# Altium project PCB_Project.PrjPcb (part 2 of 2)
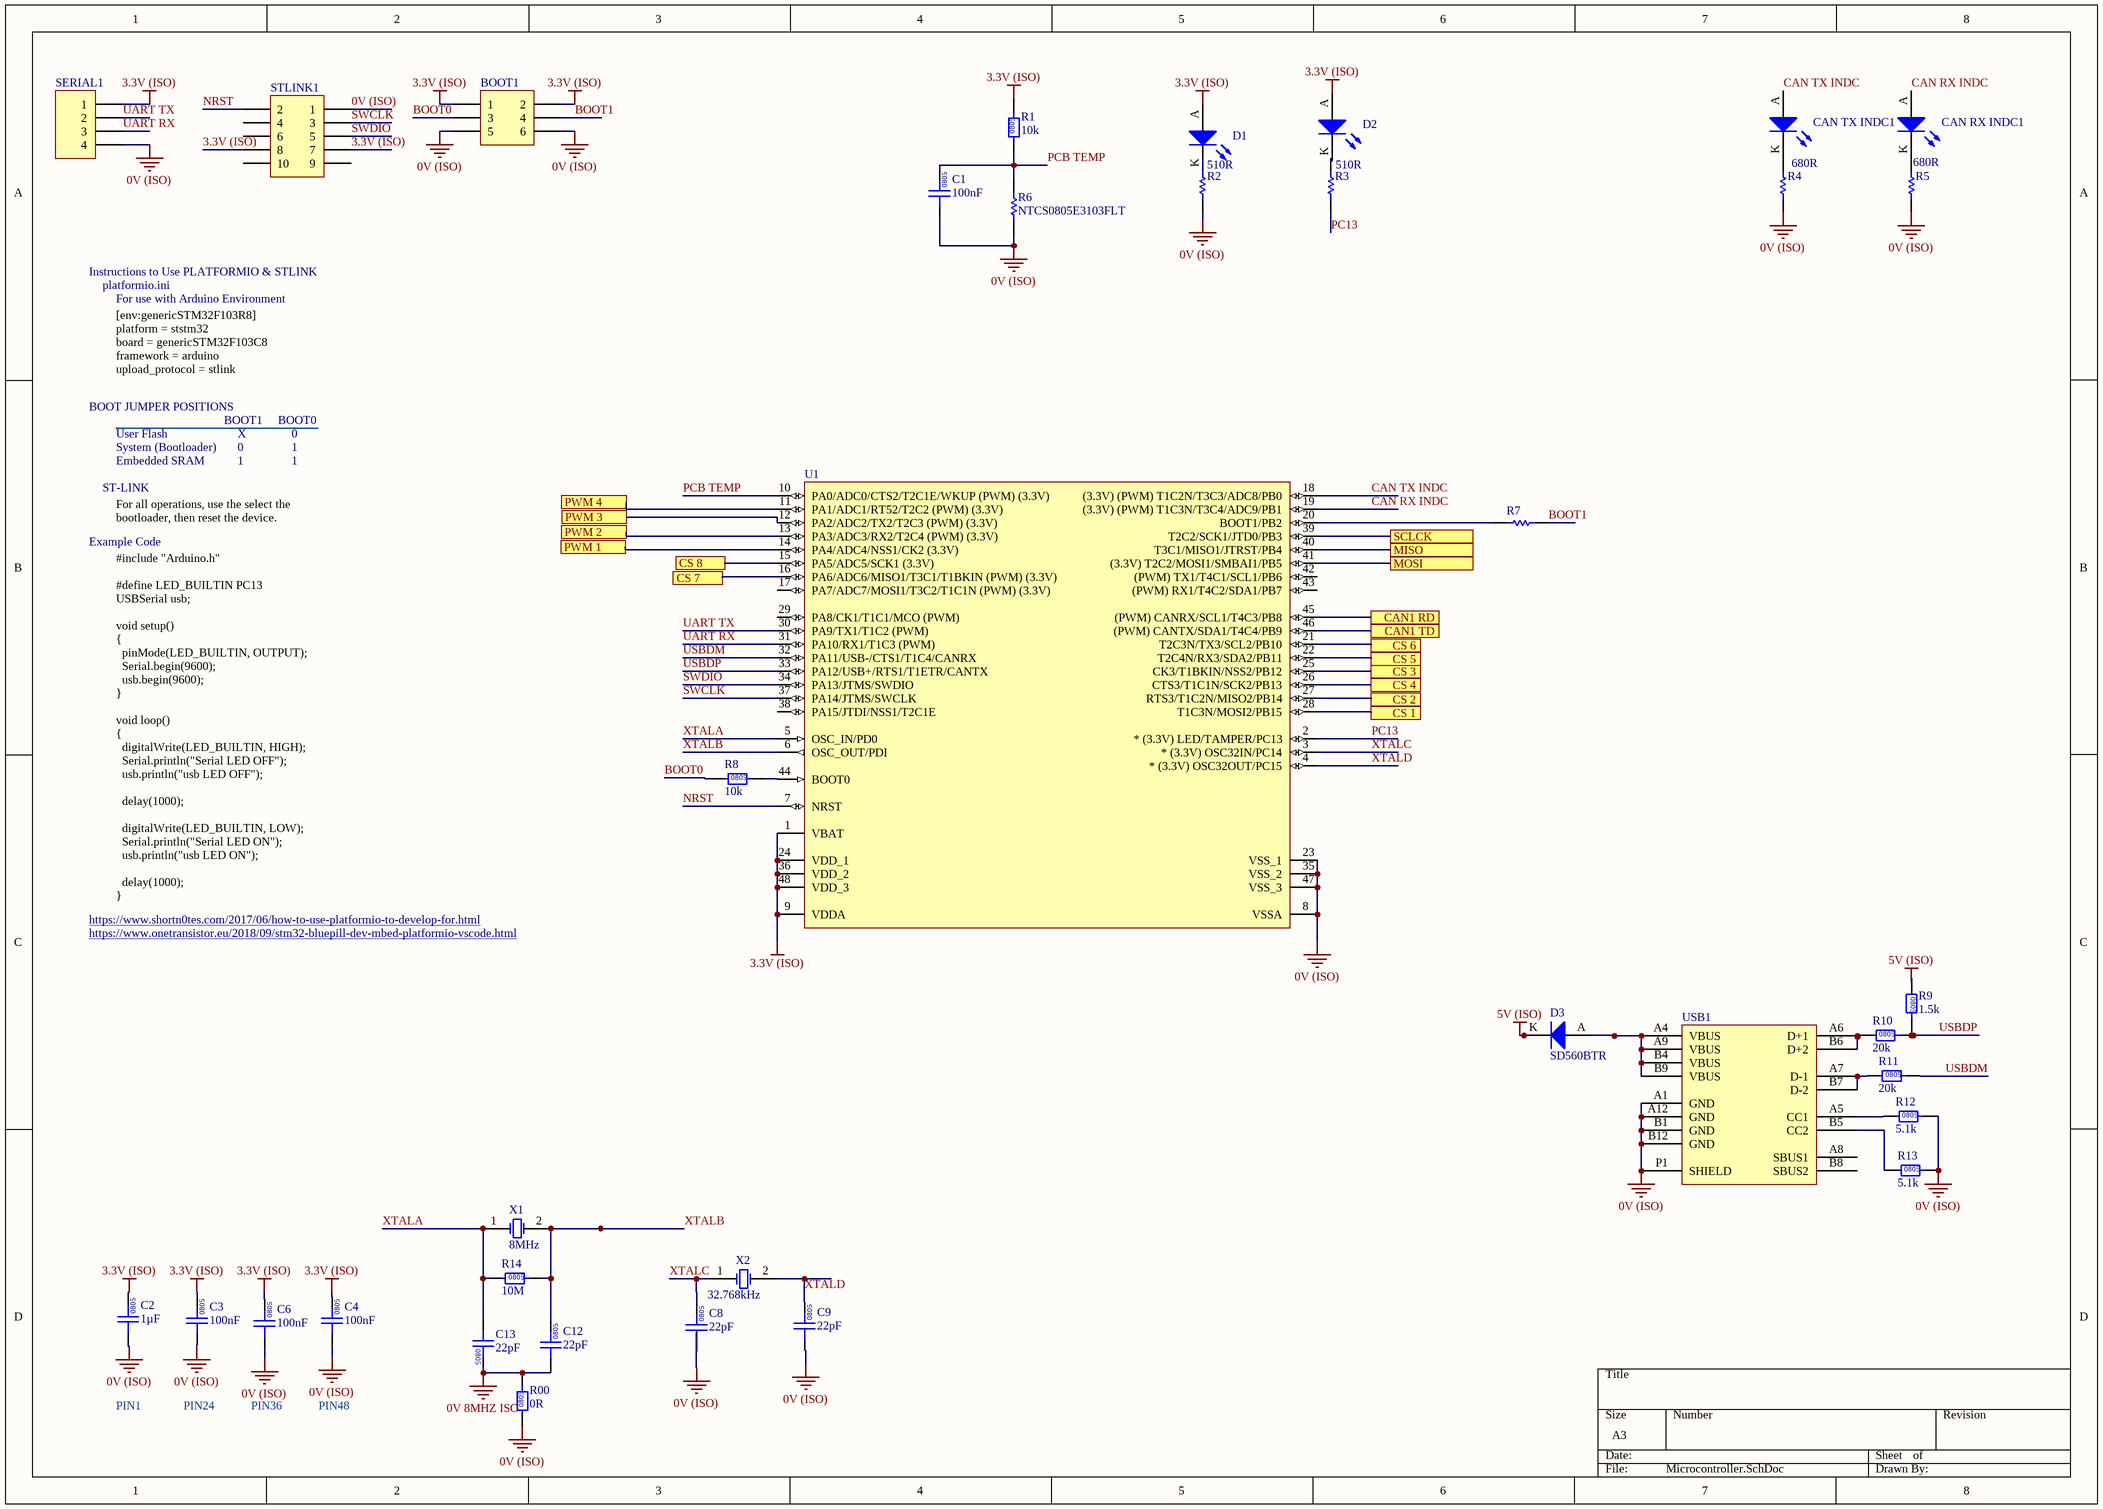
[diagram p9: Microcontroller.SchDoc]

## Nets that join several sheets
0V: Top_Level (6 pins), Power Supply (15 pins), Power Outputs (12 pins), Power Outputs/SD1 (9 pins), Power Outputs/SD2 (9 pins), Power Outputs/SD3 (9 pins), Power Outputs/SD4 (9 pins), PWM Signal Isolation (U14.9 U14.15), Digital Isolation (6 pins), HBA (9 pins), HBB (9 pins), HBC (9 pins), HBD (9 pins)
0V (ISO): Power Supply (8 pins), CAN (9 pins), PWM Signal Isolation (U14.2 U14.8), Digital Isolation (6 pins), Microcontroller (27 pins)
3.3V (ISO): Power Supply (C34.2 C38.2 U6.5), PWM Signal Isolation (U14.1), Digital Isolation (U10.1 U11.1 U12.1 U12.7), Microcontroller (17 pins)
5V: Power Supply (6 pins), Power Outputs (15 pins), PWM Signal Isolation (U14.10 U14.16), Digital Isolation (6 pins), HBA (R39_HBA.2 U13_HBA.2), HBB (R39_HBB.2 U13_HBB.2), HBC (R39_HBC.2 U13_HBC.2), HBD (R39_HBD.2 U13_HBD.2)
5V (ISO): Power Supply (7 pins), CAN (6 pins), Microcontroller (D3.K R9.1)
24V PWR: Power Supply (*1.5 *2.8 C24.2 F1.1), Power Outputs/SD1 (U3_SD1.15), Power Outputs/SD2 (U3_SD2.15), Power Outputs/SD3 (U3_SD3.15), Power Outputs/SD4 (U3_SD4.15)
ADC CS (ISO): Digital Isolation (U10.3), Microcontroller (U1.28)
ADC CS (NON ISO): Power Outputs (*6.11 R32.1), Digital Isolation (U10.14)
CAN_H: Top_Level (J1.6), CAN (C47.2 U8.2)
CAN_L: Top_Level (J1.5), CAN (C48.2 U8.1)
CANS: Top_Level (J1.7), CAN (14 pins)
CURRENT SENSE CH1: Power Outputs (*6.15), Power Outputs/SD1 (C15_SD1.2 R15_SD1.1)
CURRENT SENSE CH2: Power Outputs (*6.16), Power Outputs/SD1 (C14_SD1.2 R16_SD1.2)
CURRENT SENSE CH3: Power Outputs (*6.1), Power Outputs/SD2 (C15_SD2.2 R15_SD2.1)
CURRENT SENSE CH4: Power Outputs (*6.2), Power Outputs/SD2 (C14_SD2.2 R16_SD2.2)
CURRENT SENSE CH5: Power Outputs (*6.3), Power Outputs/SD3 (C15_SD3.2 R15_SD3.1)
CURRENT SENSE CH6: Power Outputs (*6.4), Power Outputs/SD3 (C14_SD3.2 R16_SD3.2)
CURRENT SENSE CH7: Power Outputs (*6.5), Power Outputs/SD4 (C15_SD4.2 R15_SD4.1)
CURRENT SENSE CH8: Power Outputs (*6.6), Power Outputs/SD4 (C14_SD4.2 R16_SD4.2)
DIAGNOSTIC EN A: Power Outputs (*4.15), Power Outputs/SD1 (R19_SD1.1)
DIAGNOSTIC EN B: Power Outputs (*4.16), Power Outputs/SD2 (R19_SD2.1)
DIAGNOSTIC EN C: Power Outputs (*4.1), Power Outputs/SD3 (R19_SD3.1)
DIAGNOSTIC EN D: Power Outputs (*4.2), Power Outputs/SD4 (R19_SD4.1)
GLV+: Top_Level (J1.1 J1.2), Power Supply (J2.1 J2.2)
H Bridge A CS: Digital Isolation (U11.14), HBA (R39_HBA.1 U13_HBA.9)
H Bridge A CS (ISO): Digital Isolation (U11.3), Microcontroller (U1.22)
H Bridge A Direction: Power Outputs (*4.3), HBA (U13_HBA.1)
H Bridge A OUT1: Top_Level (J1.28), HBA (C66_HBA.2 U13_HBA.5)
H Bridge A OUT2: Top_Level (J1.27), HBA (C67_HBA.2 U13_HBA.7)
H Bridge A Power: Power Outputs/SD3 (5 pins), HBA (C60_HBA.2 C65_HBA.2 U13_HBA.4)
H Bridge B CS: Digital Isolation (U11.13), HBB (R39_HBB.1 U13_HBB.9)
H Bridge B CS (ISO): Digital Isolation (U11.4), Microcontroller (U1.21)
H Bridge B Direction: Power Outputs (*4.4), HBB (U13_HBB.1)
H Bridge B OUT1: Top_Level (J1.30), HBB (C66_HBB.2 U13_HBB.5)
H Bridge B OUT2: Top_Level (J1.29), HBB (C67_HBB.2 U13_HBB.7)
H Bridge B Power: Power Outputs/SD3 (5 pins), HBB (C60_HBB.2 C65_HBB.2 U13_HBB.4)
H Bridge C CS: Digital Isolation (U11.12), HBC (R39_HBC.1 U13_HBC.9)
H Bridge C CS (ISO): Digital Isolation (U11.5), Microcontroller (U1.16)
H Bridge C Direction: Power Outputs (*4.5), HBC (U13_HBC.1)
H Bridge C OUT1: Top_Level (J1.25), HBC (C66_HBC.2 U13_HBC.5)
H Bridge C OUT2: Top_Level (J1.34), HBC (C67_HBC.2 U13_HBC.7)
H Bridge C Power: Power Outputs/SD4 (5 pins), HBC (C60_HBC.2 C65_HBC.2 U13_HBC.4)
H Bridge D CS: Digital Isolation (U11.11), HBD (R39_HBD.1 U13_HBD.9)
H Bridge D CS (ISO): Digital Isolation (U11.6), Microcontroller (U1.15)
H Bridge D Direction: Power Outputs (*4.6), HBD (U13_HBD.1)
H Bridge D OUT1: Top_Level (J1.8), HBD (C66_HBD.2 U13_HBD.5)
H Bridge D OUT2: Top_Level (J1.9), HBD (C67_HBD.2 U13_HBD.7)
H Bridge D Power: Power Outputs/SD4 (5 pins), HBD (C60_HBD.2 C65_HBD.2 U13_HBD.4)
MISO: Power Outputs (*4.12 *5.12 *6.12), Digital Isolation (R38.2), HBA (U13_HBA.3), HBB (U13_HBB.3), HBC (U13_HBC.3), HBD (U13_HBD.3)
MISO (ISO): Digital Isolation (R37.1), Microcontroller (U1.40)
MOSI: Power Outputs (*4.14 *5.14 *6.14), Digital Isolation (R33.1), HBA (U13_HBA.8), HBB (U13_HBB.8), HBC (U13_HBC.8), HBD (U13_HBD.8)
MOSI (ISO): Digital Isolation (R34.1), Microcontroller (U1.41)
NetU1_11: PWM Signal Isolation (U14.6), Microcontroller (U1.11)
NetU1_12: PWM Signal Isolation (U14.5), Microcontroller (U1.12)
NetU1_13: PWM Signal Isolation (U14.4), Microcontroller (U1.13)
NetU1_14: PWM Signal Isolation (U14.3), Microcontroller (U1.14)
NetU1_45: CAN (U7.4), Microcontroller (U1.45)
NetU1_46: CAN (U7.5), Microcontroller (U1.46)
PWM 1: PWM Signal Isolation (U14.14), HBA (U13_HBA.12)
PWM 2: PWM Signal Isolation (U14.13), HBB (U13_HBB.12)
PWM 3: PWM Signal Isolation (U14.12), HBC (U13_HBC.12)
PWM 4: PWM Signal Isolation (U14.11), HBD (U13_HBD.12)
SCLCK: Power Outputs (*4.13 *5.13 *6.13), Digital Isolation (R36.1), HBA (U13_HBA.10), HBB (U13_HBB.10), HBC (U13_HBC.10), HBD (U13_HBD.10)
SCLCK (ISO): Digital Isolation (R35.1), Microcontroller (U1.39)
Smart Driver 1: Top_Level (J1.13), Power Outputs/SD1 (5 pins)
Smart Driver 2: Top_Level (J1.12), Power Outputs/SD1 (5 pins)
Smart Driver 3: Top_Level (J1.11), Power Outputs/SD2 (5 pins)
Smart Driver 4: Top_Level (J1.10), Power Outputs/SD2 (5 pins)
SMRT DRV CTRL CH1: Power Outputs (*5.15), Power Outputs/SD1 (R20_SD1.1)
SMRT DRV CTRL CH2: Power Outputs (*5.16), Power Outputs/SD1 (R22_SD1.1)
SMRT DRV CTRL CH3: Power Outputs (*5.1), Power Outputs/SD2 (R20_SD2.1)
SMRT DRV CTRL CH4: Power Outputs (*5.2), Power Outputs/SD2 (R22_SD2.1)
SMRT DRV CTRL CH5: Power Outputs (*5.3), Power Outputs/SD3 (R20_SD3.1)
SMRT DRV CTRL CH6: Power Outputs (*5.4), Power Outputs/SD3 (R22_SD3.1)
SMRT DRV CTRL CH7: Power Outputs (*5.5), Power Outputs/SD4 (R20_SD4.1)
SMRT DRV CTRL CH8: Power Outputs (*5.6), Power Outputs/SD4 (R22_SD4.1)
SMRT DRV CTRL CS (ISO): Digital Isolation (U10.4), Microcontroller (U1.27)
SMRT DRV CTRL CS (NON ISO): Power Outputs (*5.11 R31.1), Digital Isolation (U10.13)
SMRT DRV DIG CS (ISO): Digital Isolation (U10.5), Microcontroller (U1.25)
SMRT DRV DIG CS (NON ISO): Power Outputs (*4.11 R30.1), Digital Isolation (U10.12)